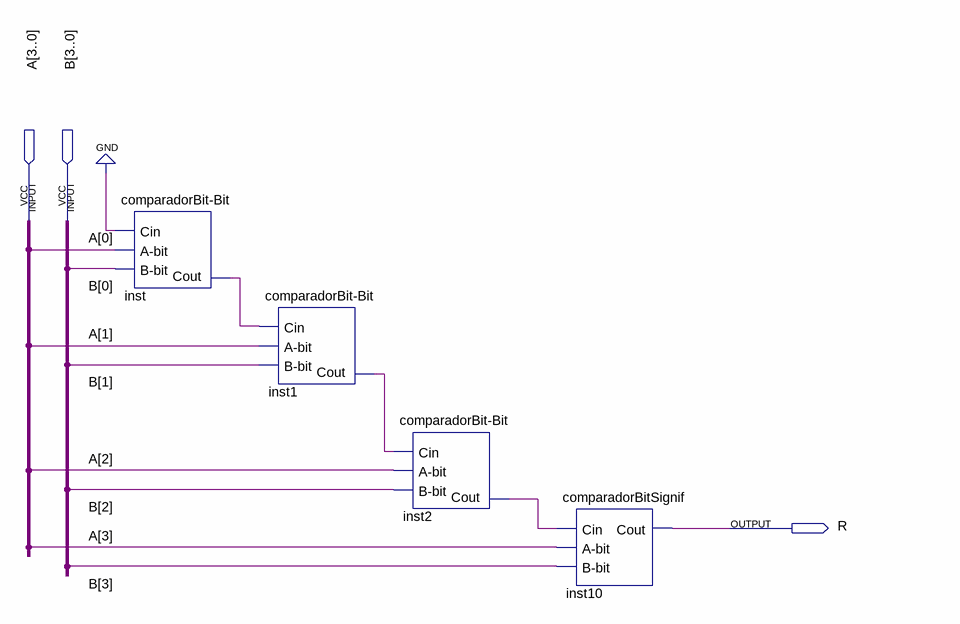
[diagram p0: schematic sheet]
// Quartus schematic maiorQueDiferenciado.bdf as structural Verilog: 4 symbols, 3 pins
module maiorQueDiferenciado (
  input  [3:0] A,
  input  [3:0] B,
  output R
);

  wire inst1_cout, inst2_cout, inst_cout;

  \comparadorBit-Bit  inst (.Cin(1'b0), .\A-bit (A[0]), .\B-bit (B[0]), .Cout(inst_cout));
  \comparadorBit-Bit  inst1 (.Cin(inst_cout), .\A-bit (A[1]), .\B-bit (B[1]), .Cout(inst1_cout));
  \comparadorBit-Bit  inst2 (.Cin(inst1_cout), .\A-bit (A[2]), .\B-bit (B[2]), .Cout(inst2_cout));
  comparadorBitSignif inst10 (.Cin(inst2_cout), .\A-bit (A[3]), .\B-bit (B[3]), .Cout(R));
endmodule
